# EasyEDA schematic 1-Schematic_LNA, Bias Tee powered + filtering (SMD, ENCLOSURE).json
TITLE: LNA, Bias Tee powered + filtering (SMD, ENCLOSURE): Main module; REV: 1.0.EE; Date: 2020-04-15; Sheet: 1/1; Drawn By: IgrikXD; Company: Easy-SDR
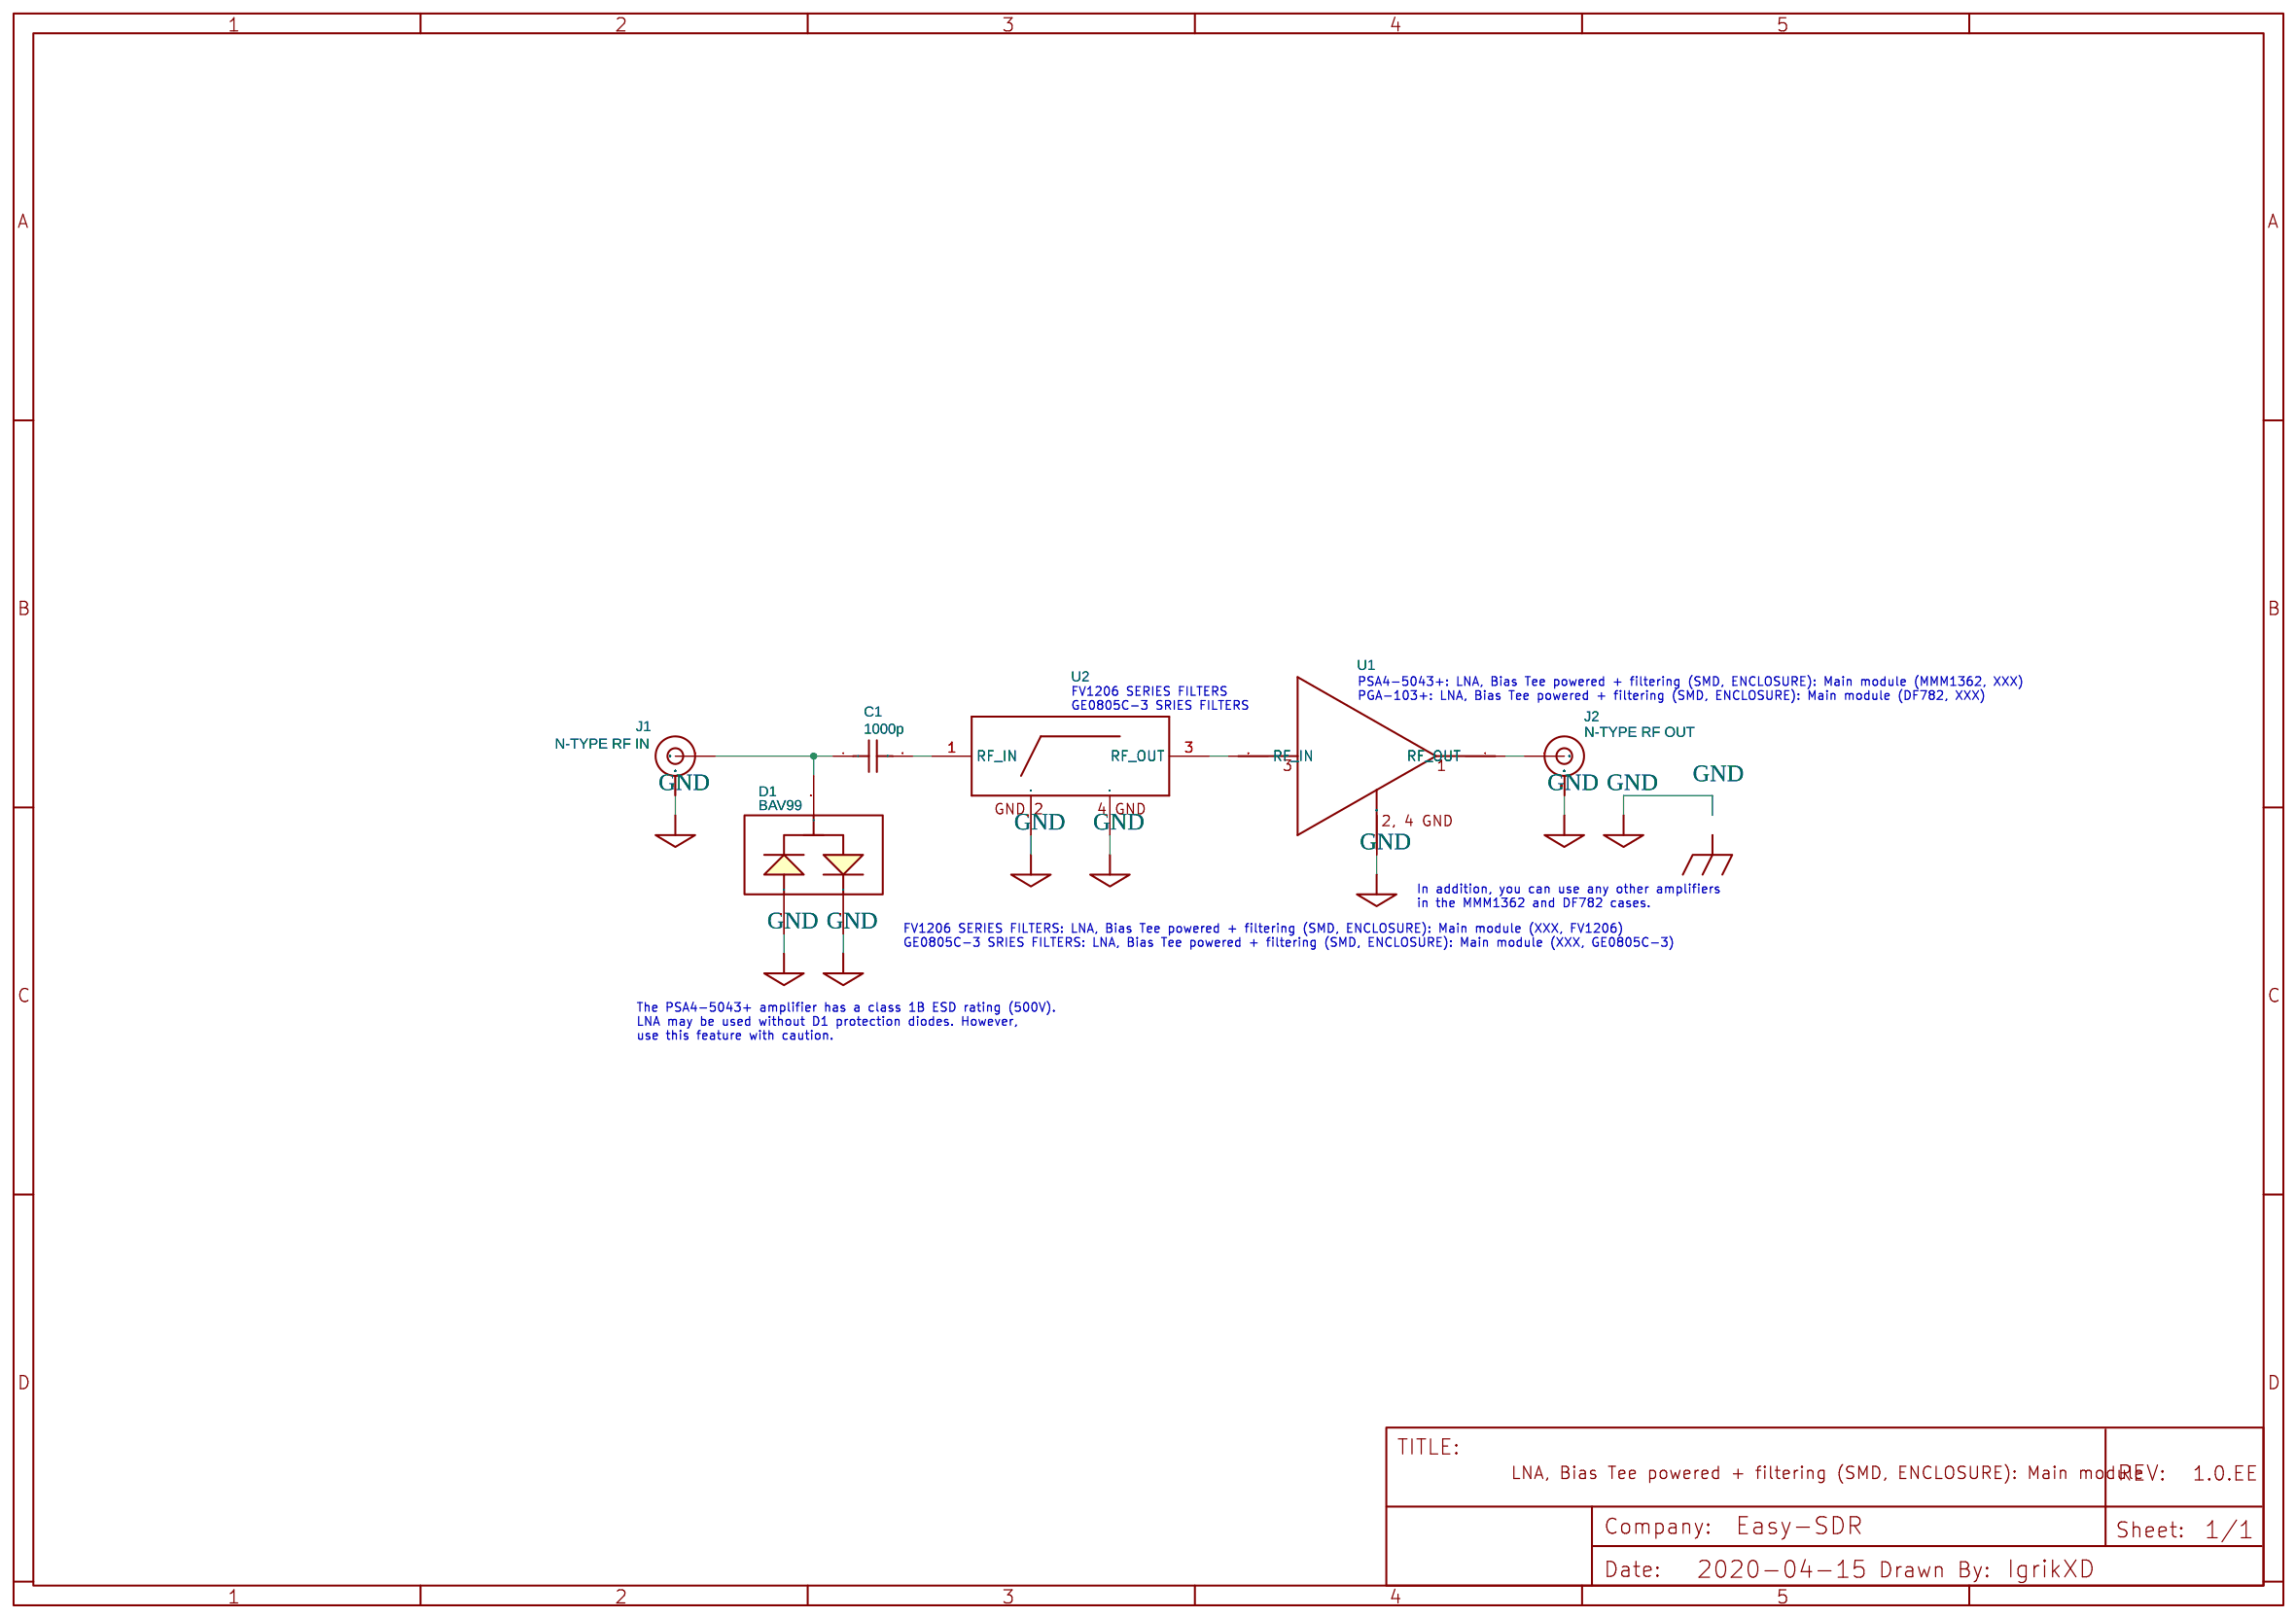
[diagram p0: schematic sheet]

## Parts
C1  1000p  [0603 WITHOUT MASK]
D1  BAV99  [SOT-23-3 WITHOUT MASK]
J1  N-TYPE RF IN  [N-TYPE 25*25]
J2  N-TYPE RF OUT  [N-TYPE 25*25]
U1  PSA4-5043+  [MMM1362 (SPCB) WITHOUT MASK]
U2  FV1206 SERIES FILTERS  [FV1206 WITHOUT MASK]

## Library data of the parts
C1 = Capacitor: Manufacturer Part: 0603N102G500CT; Supplier: LCSC; Manufacturer: Walsin Tech Corp; Supplier Part: C338154
D1 = -: Supplier: LCSC; Manufacturer: SEMTECH; Contributor: IgrikXD; Supplier Part: C83868
J1 J2 = -: Contributor: IgrikXD; Manufacturer Part: 82-97-RFX; Supplier: Digi-Key; Supplier Part: ARFX1023-ND; Manufacturer: Amphenol RF
U1 = PSA4-5043+: Contributor: IgrikXD
U2 = HPF-FV1206: Supplier: Mini-Circuits; Manufacturer: Mini-Circuits; Contributor: IgrikXD

## Nets
GND: D1.1 D1.2 J1.1(GND) J1.3(GND) J1.4(GND) J1.5(GND) J2.1(GND) J2.3(GND) J2.4(GND) J2.5(GND) U1.2(GND) U1.4(GND) U2.2(GND) U2.4(GND)
Net-(C1-1): C1.1 D1.3 J1.2(SIGNAL)
Net-(C1-2): C1.2 U2.1(RF IN)
Net-(J2-2): J2.2(SIGNAL) U1.1(RF OUT)
Net-(U1-3): U1.3(RF IN) U2.3(RF OUT)

## Notes on the sheet
- PSA4-5043+: LNA, Bias Tee powered + filtering (SMD, ENCLOSURE): Main module (MMM1362, XXX)
  PGA-103+: LNA, Bias Tee powered + filtering (SMD, ENCLOSURE): Main module (DF782, XXX)
- FV1206 SERIES FILTERS
  GE0805C-3 SRIES FILTERS
- In addition, you can use any other amplifiers
  in the MMM1362 and DF782 cases.
- FV1206 SERIES FILTERS: LNA, Bias Tee powered + filtering (SMD, ENCLOSURE): Main module (XXX, FV1206)
  GE0805C-3 SRIES FILTERS: LNA, Bias Tee powered + filtering (SMD, ENCLOSURE): Main module (XXX, GE0805C-3)
- The PSA4-5043+ amplifier has a class 1B ESD rating (500V).
  LNA may be used without D1 protection diodes. However,
  use this feature with caution.
